# Altium schematic sheet 08_FPGA_banks_3_4_5.SchDoc: FPGA banks 3, 4, 5
size A3; Organization: Lime Microsystems; Address1: Surrey Tech Centre; Address2: Guildford GU2 7YG; Address3: Surrey; Address4: United Kingdom; Revision: v1.2; SheetNumber: 8; SheetTotal: 16
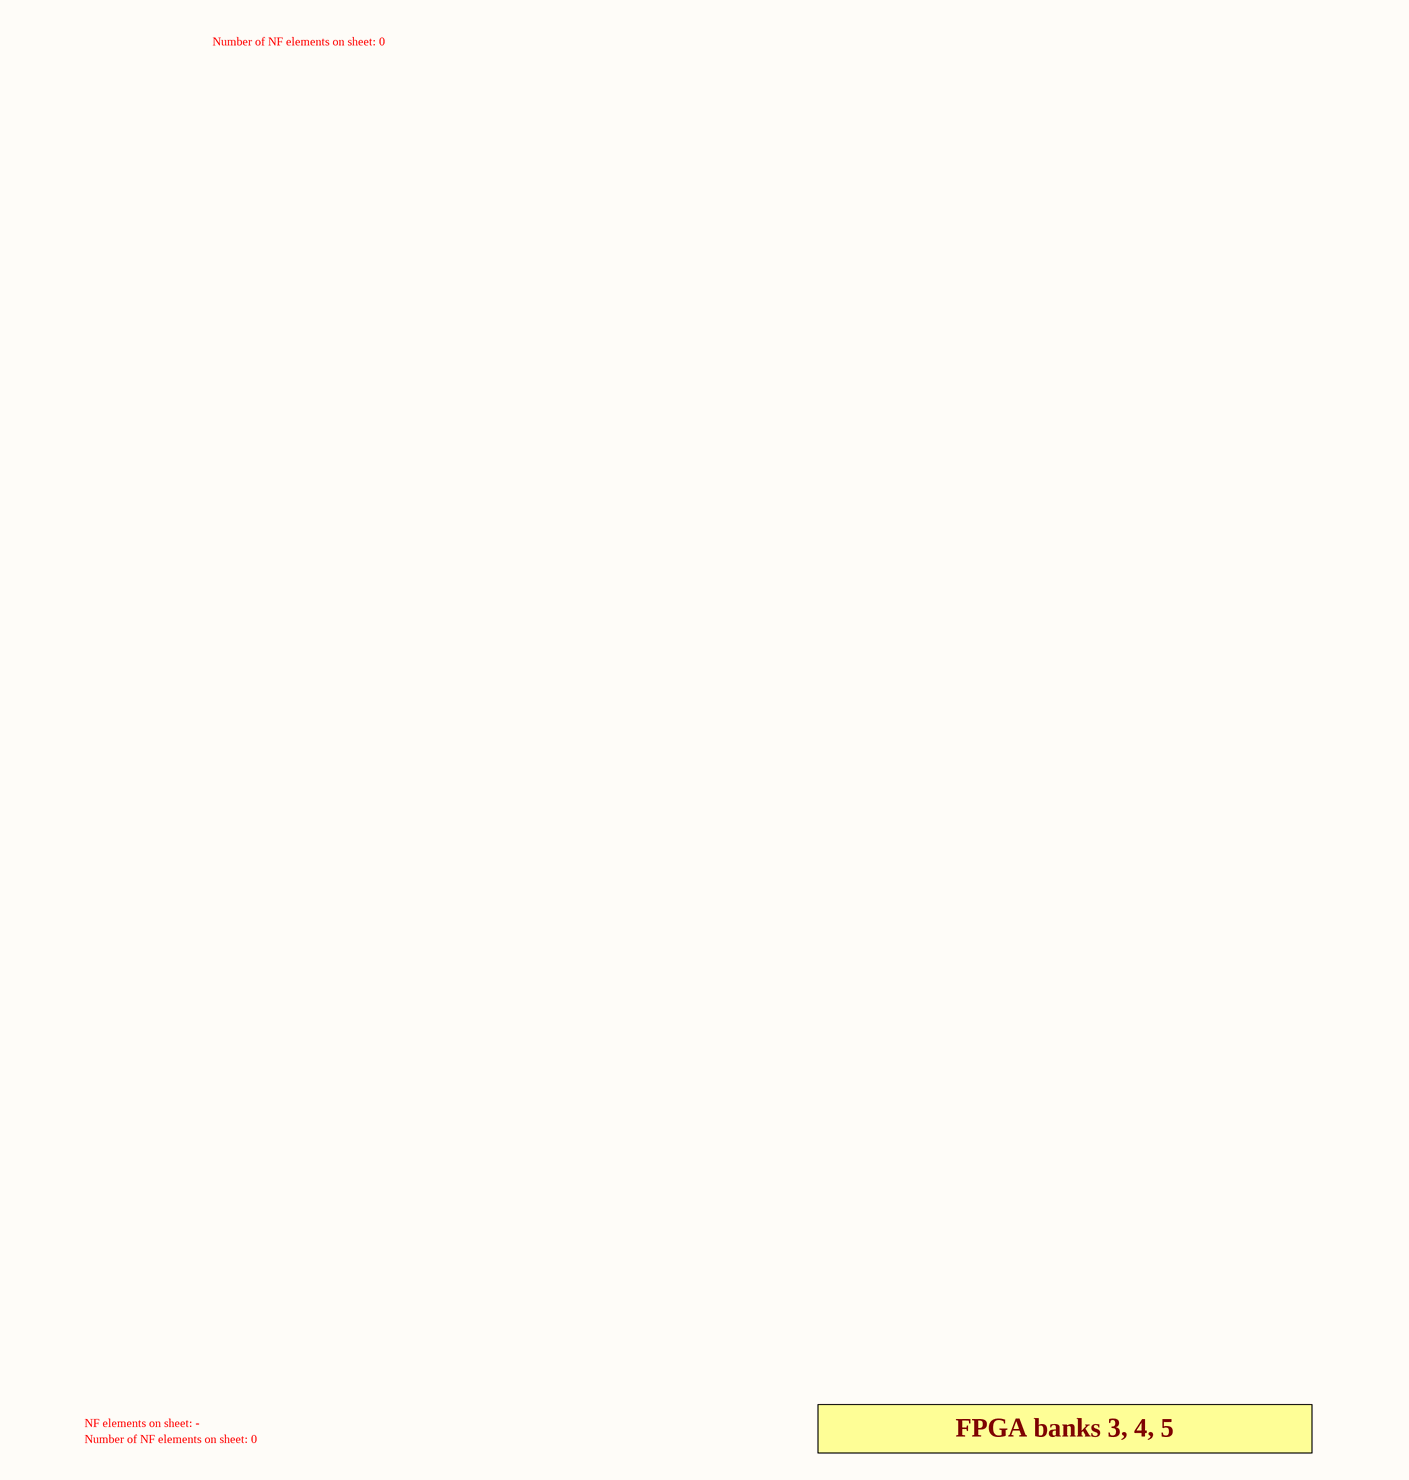
[diagram p0: 08_FPGA_banks_3_4_5.SchDoc, top]
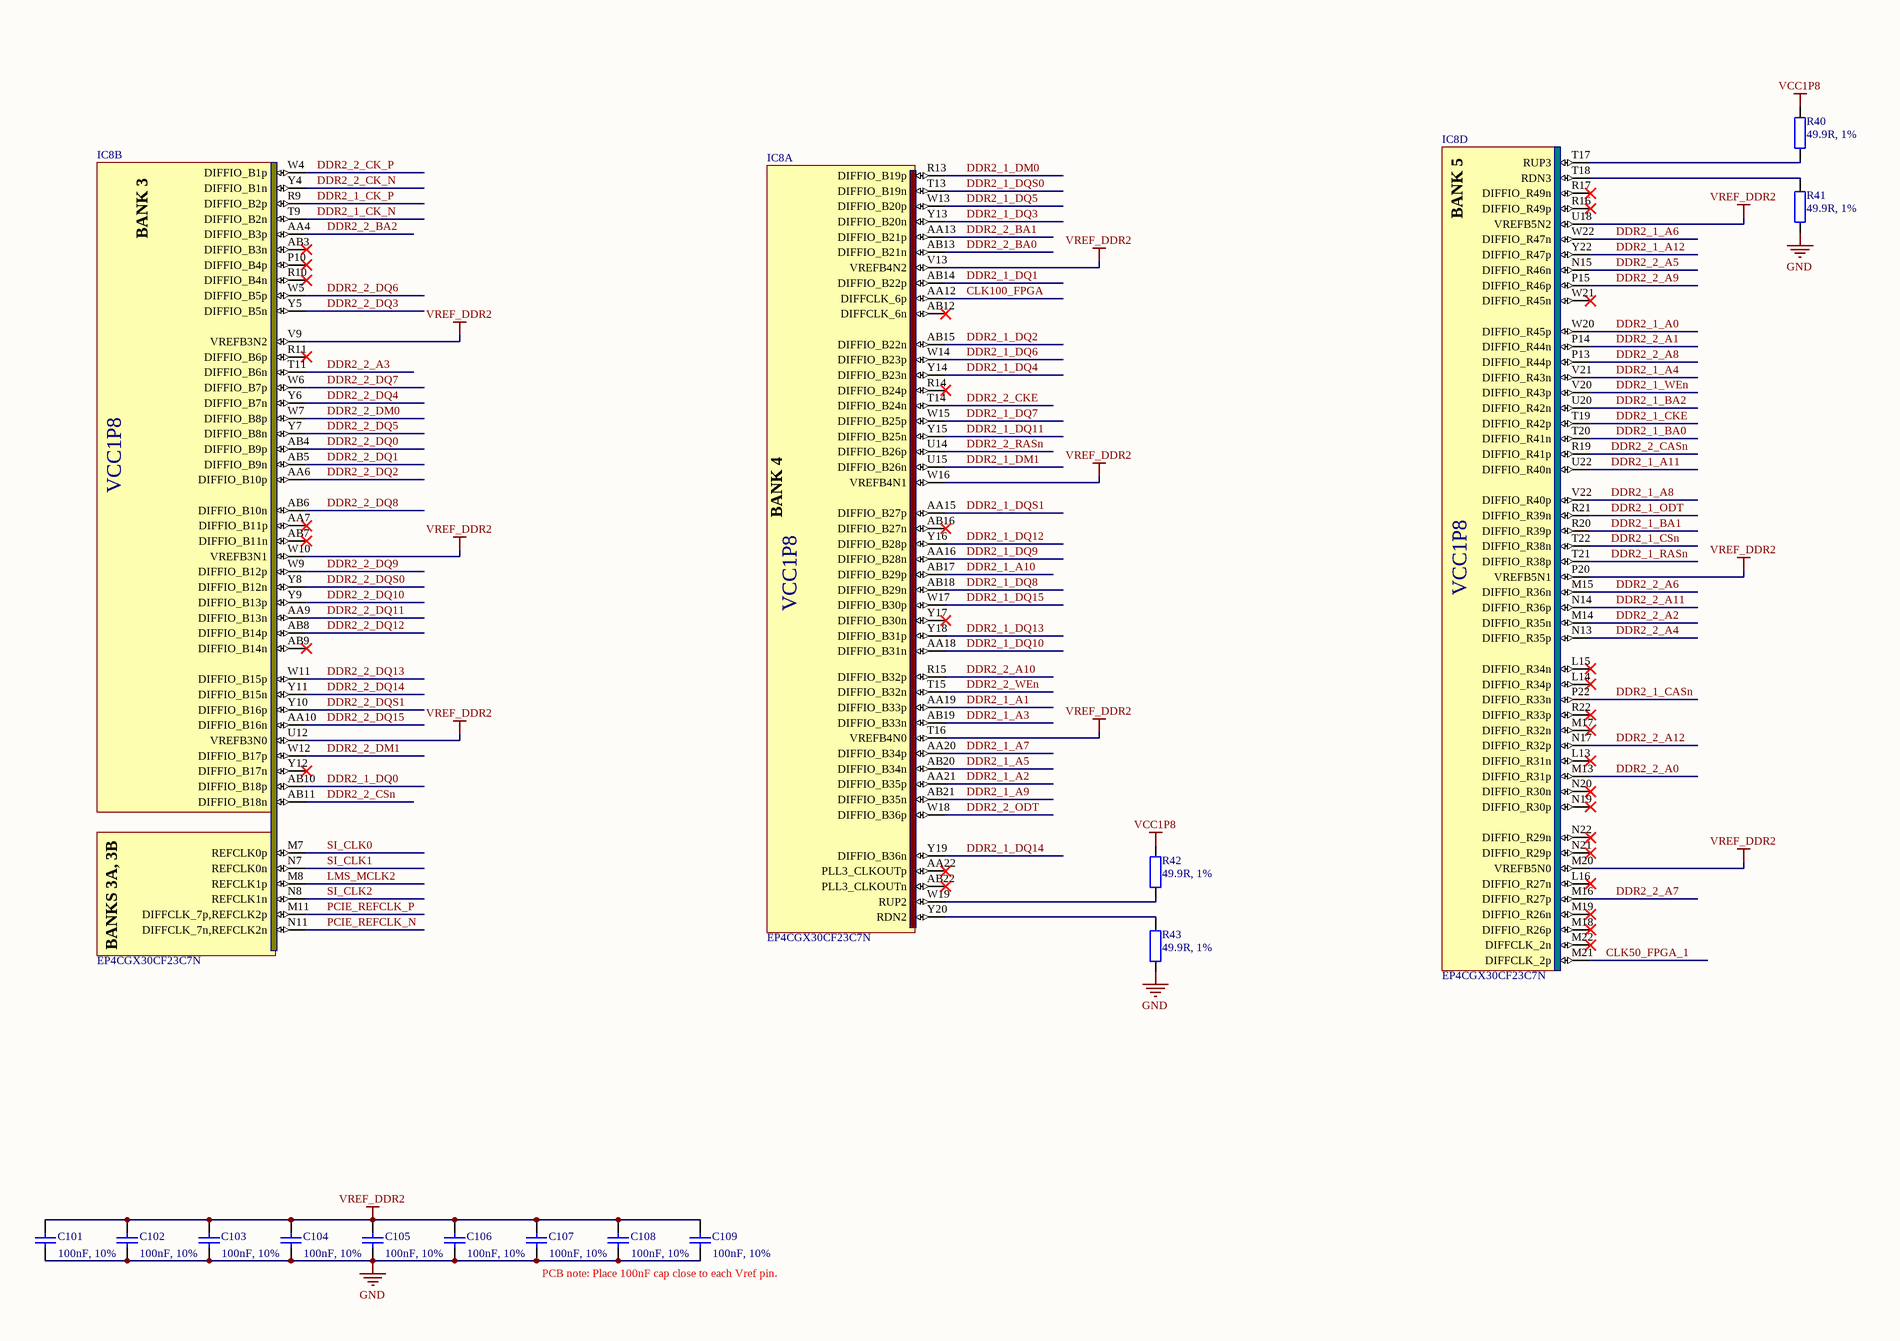
[diagram p1: 08_FPGA_banks_3_4_5.SchDoc, bottom]

## Parts
C101  100nF, 10%  [CAP0402]
C102  100nF, 10%  [CAP0402]
C103  100nF, 10%  [CAP0402]
C104  100nF, 10%  [CAP0402]
C105  100nF, 10%  [CAP0402]
C106  100nF, 10%  [CAP0402]
C107  100nF, 10%  [CAP0402]
C108  100nF, 10%  [CAP0402]
C109  100nF, 10%  [CAP0402]
IC8  EP4CGX30CF23C7N  [ALTR-FBGA484_A-200]  (parts A,B,D of 10)
R40  49.9R, 1%  [RES0402]
R41  49.9R, 1%  [RES0402]
R42  49.9R, 1%  [RES0402]
R43  49.9R, 1%  [RES0402]

## Nets
GND: C101.2 C102.2 C103.2 C104.2 C105.2 C106.2 C107.2 C108.2 C109.2 R41.1 R43.1
VCC1P8: R40.2 R42.2
VREF_DDR2: C101.1 C102.1 C103.1 C104.1 C105.1 C106.1 C107.1 C108.1 C109.1 IC8.M20(VREFB5N0) IC8.P20(VREFB5N1) IC8.T16(VREFB4N0) IC8.U12(VREFB3N0) IC8.U18(VREFB5N2) IC8.V9(VREFB3N2) IC8.V13(VREFB4N2) IC8.W10(VREFB3N1) IC8.W16(VREFB4N1)
CLK50_FPGA_1: IC8.M21(DIFFCLK_2p)
CLK100_FPGA: IC8.AA12(DIFFCLK_6p)
DDR2_1_A0: IC8.W20(DIFFIO_R45p)
DDR2_1_A1: IC8.AA19(DIFFIO_B33p)
DDR2_1_A2: IC8.AA21(DIFFIO_B35p)
DDR2_1_A3: IC8.AB19(DIFFIO_B33n)
DDR2_1_A4: IC8.V21(DIFFIO_R43n)
DDR2_1_A5: IC8.AB20(DIFFIO_B34n)
DDR2_1_A6: IC8.W22(DIFFIO_R47n)
DDR2_1_A7: IC8.AA20(DIFFIO_B34p)
DDR2_1_A8: IC8.V22(DIFFIO_R40p)
DDR2_1_A9: IC8.AB21(DIFFIO_B35n)
DDR2_1_A10: IC8.AB17(DIFFIO_B29p)
DDR2_1_A11: IC8.U22(DIFFIO_R40n)
DDR2_1_A12: IC8.Y22(DIFFIO_R47p)
DDR2_1_BA0: IC8.T20(DIFFIO_R41n)
DDR2_1_BA1: IC8.R20(DIFFIO_R39p)
DDR2_1_BA2: IC8.U20(DIFFIO_R42n)
DDR2_1_CASn: IC8.P22(DIFFIO_R33n)
DDR2_1_CK_N: IC8.T9(DIFFIO_B2n)
DDR2_1_CK_P: IC8.R9(DIFFIO_B2p)
DDR2_1_CKE: IC8.T19(DIFFIO_R42p)
DDR2_1_CSn: IC8.T22(DIFFIO_R38n)
DDR2_1_DM0: IC8.R13(DIFFIO_B19p)
DDR2_1_DM1: IC8.U15(DIFFIO_B26n)
DDR2_1_DQ0: IC8.AB10(DIFFIO_B18p)
DDR2_1_DQ1: IC8.AB14(DIFFIO_B22p)
DDR2_1_DQ2: IC8.AB15(DIFFIO_B22n)
DDR2_1_DQ3: IC8.Y13(DIFFIO_B20n)
DDR2_1_DQ4: IC8.Y14(DIFFIO_B23n)
DDR2_1_DQ5: IC8.W13(DIFFIO_B20p)
DDR2_1_DQ6: IC8.W14(DIFFIO_B23p)
DDR2_1_DQ7: IC8.W15(DIFFIO_B25p)
DDR2_1_DQ8: IC8.AB18(DIFFIO_B29n)
DDR2_1_DQ9: IC8.AA16(DIFFIO_B28n)
DDR2_1_DQ10: IC8.AA18(DIFFIO_B31n)
DDR2_1_DQ11: IC8.Y15(DIFFIO_B25n)
DDR2_1_DQ12: IC8.Y16(DIFFIO_B28p)
DDR2_1_DQ13: IC8.Y18(DIFFIO_B31p)
DDR2_1_DQ14: IC8.Y19(DIFFIO_B36n)
DDR2_1_DQ15: IC8.W17(DIFFIO_B30p)
DDR2_1_DQS0: IC8.T13(DIFFIO_B19n)
DDR2_1_DQS1: IC8.AA15(DIFFIO_B27p)
DDR2_1_ODT: IC8.R21(DIFFIO_R39n)
DDR2_1_RASn: IC8.T21(DIFFIO_R38p)
DDR2_1_WEn: IC8.V20(DIFFIO_R43p)
DDR2_2_A0: IC8.M13(DIFFIO_R31p)
DDR2_2_A1: IC8.P14(DIFFIO_R44n)
DDR2_2_A2: IC8.M14(DIFFIO_R35n)
DDR2_2_A3: IC8.T11(DIFFIO_B6n)
DDR2_2_A4: IC8.N13(DIFFIO_R35p)
DDR2_2_A5: IC8.N15(DIFFIO_R46n)
DDR2_2_A6: IC8.M15(DIFFIO_R36n)
DDR2_2_A7: IC8.M16(DIFFIO_R27p)
DDR2_2_A8: IC8.P13(DIFFIO_R44p)
DDR2_2_A9: IC8.P15(DIFFIO_R46p)
DDR2_2_A10: IC8.R15(DIFFIO_B32p)
DDR2_2_A11: IC8.N14(DIFFIO_R36p)
DDR2_2_A12: IC8.N17(DIFFIO_R32p)
DDR2_2_BA0: IC8.AB13(DIFFIO_B21n)
DDR2_2_BA1: IC8.AA13(DIFFIO_B21p)
DDR2_2_BA2: IC8.AA4(DIFFIO_B3p)
DDR2_2_CASn: IC8.R19(DIFFIO_R41p)
DDR2_2_CK_N: IC8.Y4(DIFFIO_B1n)
DDR2_2_CK_P: IC8.W4(DIFFIO_B1p)
DDR2_2_CKE: IC8.T14(DIFFIO_B24n)
DDR2_2_CSn: IC8.AB11(DIFFIO_B18n)
DDR2_2_DM0: IC8.W7(DIFFIO_B8p)
DDR2_2_DM1: IC8.W12(DIFFIO_B17p)
DDR2_2_DQ0: IC8.AB4(DIFFIO_B9p)
DDR2_2_DQ1: IC8.AB5(DIFFIO_B9n)
DDR2_2_DQ2: IC8.AA6(DIFFIO_B10p)
DDR2_2_DQ3: IC8.Y5(DIFFIO_B5n)
DDR2_2_DQ4: IC8.Y6(DIFFIO_B7n)
DDR2_2_DQ5: IC8.Y7(DIFFIO_B8n)
DDR2_2_DQ6: IC8.W5(DIFFIO_B5p)
DDR2_2_DQ7: IC8.W6(DIFFIO_B7p)
DDR2_2_DQ8: IC8.AB6(DIFFIO_B10n)
DDR2_2_DQ9: IC8.W9(DIFFIO_B12p)
DDR2_2_DQ10: IC8.Y9(DIFFIO_B13p)
DDR2_2_DQ11: IC8.AA9(DIFFIO_B13n)
DDR2_2_DQ12: IC8.AB8(DIFFIO_B14p)
DDR2_2_DQ13: IC8.W11(DIFFIO_B15p)
DDR2_2_DQ14: IC8.Y11(DIFFIO_B15n)
DDR2_2_DQ15: IC8.AA10(DIFFIO_B16n)
DDR2_2_DQS0: IC8.Y8(DIFFIO_B12n)
DDR2_2_DQS1: IC8.Y10(DIFFIO_B16p)
DDR2_2_ODT: IC8.W18(DIFFIO_B36p)
DDR2_2_RASn: IC8.U14(DIFFIO_B26p)
DDR2_2_WEn: IC8.T15(DIFFIO_B32n)
LMS_MCLK2: IC8.M8(REFCLK1p)
PCIE_REFCLK_N: IC8.N11(DIFFCLK_7n,REFCLK2n)
PCIE_REFCLK_P: IC8.M11(DIFFCLK_7p,REFCLK2p)
SI_CLK0: IC8.M7(REFCLK0p)
SI_CLK1: IC8.N7(REFCLK0n)
SI_CLK2: IC8.N8(REFCLK1n)
NetIC8_T17: IC8.T17(RUP3) R40.1
NetIC8_T18: IC8.T18(RDN3) R41.2
NetIC8_W19: IC8.W19(RUP2) R42.1
NetIC8_Y20: IC8.Y20(RDN2) R43.2

Not connected (* = marked no-connect by the designer): IC8 AA7(DIFFIO_B11p)* AA22(PLL3_CLKOUTp)* AB3(DIFFIO_B3n)* AB7(DIFFIO_B11n)* AB9(DIFFIO_B14n)* AB12(DIFFCLK_6n)* AB16(DIFFIO_B27n)* AB22(PLL3_CLKOUTn)* L13(DIFFIO_R31n)* L14(DIFFIO_R34p)* L15(DIFFIO_R34n)* L16(DIFFIO_R27n)* M17(DIFFIO_R32n)* M18(DIFFIO_R26p)* M19(DIFFIO_R26n)* M22(DIFFCLK_2n)* N19(DIFFIO_R30p)* N20(DIFFIO_R30n)* N21(DIFFIO_R29p)* N22(DIFFIO_R29n)* P10(DIFFIO_B4p)* R10(DIFFIO_B4n)* R11(DIFFIO_B6p)* R14(DIFFIO_B24p)* R16(DIFFIO_R49p)* R17(DIFFIO_R49n)* R22(DIFFIO_R33p)* W21(DIFFIO_R45n)* Y12(DIFFIO_B17n)* Y17(DIFFIO_B30n)*

## Notes on the sheet
- Number of NF elements on sheet: 0
- NF elements on sheet: -
- FPGA banks 3, 4, 5
- VCC1P8
- PCB note: Place 100nF cap close to each Vref pin.
- Project name:
- Title:
- Size:
- Date:
- A3
- Revision:
- Time:
- Sheet
- of
- File:
- (in symbol EP4CGX30CF23C7N, part A) BANK 4
- (in symbol EP4CGX30CF23C7N, part B) BANK 3; BANKS 3A, 3B
- (in symbol EP4CGX30CF23C7N, part D) BANK 5

## Library data of the parts
C101-C109 = Cap_0603: Manufacturer Part Number 1: GRM155R71C104KA88D; Part Description: 0.10µF ±10% 16V X7R Ceramic Capacitor -55°C ~ 125°C Surface Mount, MLCC 0402 (1005 Metric) 0.039" L x 0.020" W (1.00mm x 0.50mm); Brand: Murata Electronics; Type: General Purpose MLCC; Capacitance: 0.1 uF; Temperature Coefficient / Code: +/- 15 %; Voltage Rating DC: 16 V; Case Height: 0.5 mm; Case Length: 1 mm; Dielectric: X7R; Supplier 1: Mouser; Supplier Part Number 1: 81-GRM155R71C104KA88; Tolerance: 10 %; Case Code - in: 0402; Manufacturer: Murata Electronics; Category: Multilayer Ceramic Capacitors MLCC - SMD/SMT; Value: 100nF, 10%; Manufacturer Part Number: GRM155R71C104KA88D; Case Code - mm: 1005; Case Width: 0.5 mm; Maximum Operating Temperature: + 125 C; Minimum Operating Temperature: - 55 C; Minimum Order Quantity: 1; Operating Temperature Range: - 55 C to + 125 C; Package / Case: 0402 (1005 metric); Packaging: Reel; Product: General Type MLCCs; Product Category: Low & Medium Capacitance SMD Ceramic Chip Capacitors; Reeling: True; RoHS - Mouser: Y; RoHS: RoHS Compliant; Series: GRM; Standard Pack Qty: 10000; Termination Style: SMD/SMT
IC8 = EP4CGX30CF23C7N: Manufacturer: Altera; Part Description: IC FPGA 290 I/O 484FBGA; Voltage - Supply: 1.16 V ~ 1.24 V; Number of I/O: 290; Total RAM Bits: 1105920; Number of Logic Elements/Cells: 29440; Number of LABs/CLBs: 1840; Supplier 1: Digi-Key; Package / Case: 484-BGA; Operating Temperature: 0°C ~ 85°C; Mounting Type: Surface Mount; Number of Gates: -; Supplier Device Package: 484-FBGA (23x23); Category: Integrated Circuits (ICs); RoHS: RoHS Compliant; Supplier Part Number 1: 544-2730-ND; Manufacturer Part Number 1: EP4CGX30CF23C7N
R40-R43 = Res_0402: Manufacturer: Samsung Electro-Mechanics America, Inc.; Manufacturer Part Number: RC1005F49R9CS; Part Description: RES SMD 49.9 OHM 1% 1/16W 0402; Temperature Coefficient: ±100ppm/°C; Resistance (Ohms): 49.9; Power (Watts): 0.063W, 1/16W; Number of Terminations: 2; Size / Dimension: 0.039" L x 0.020" W (1.00mm x 0.50mm); Supplier Device Package: 0402 (1005 Metric); RoHS: RoHS Compliant; Supplier Part Number 1: 1276-3469-6-ND; Features: -; Packaging: Digi-Reel®; Tolerance: ±1%; Height: 0.016" (0.40mm); Category: Resistors; Composition: Thick Film; Package / Case: 0402 (1005 Metric); Supplier 1: Digi-Key; Operating Temperature: -55°C ~ 155°C; Value: 49.9R, 1%